# EAGLE design transformerless_5v_AC-DC_reulator (EAGLE 9.6.2)
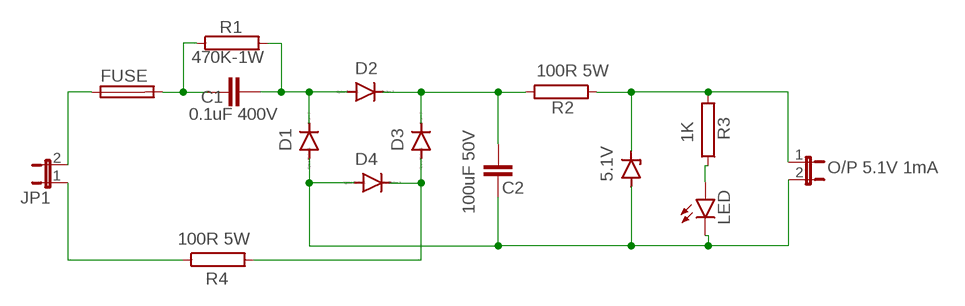
[diagram p0: schematic, sheet 1]

## Parts
C1  0.1uF 400V  C2,5-3  [C2.5-3]
C2  100uF 50V  C2,5-3  [C2.5-3]
D1  1N4004  [DO41-10]
D2  1N4004  [DO41-10]
D3  1N4004  [DO41-10]
D4  1N4004  [DO41-10]
FUSE  GSH15  [GSH15]
JP1  JP1E  [JP1]
LED  LED  [SMARTLED-TTW]
O/P  O/P 5.1V 1mA  JP1E  [JP1]
R1  470K-1W  RAC01  [AC01]
R2  100R 5W  RAC01  [AC01]
R3  1K  RAC01  [AC01]
R4  100R 5W  RAC01  [AC01]
ZENER  5.1V  ZPD  [DO35Z10]

## Nets
N$1: FUSE.1 JP1.2
N$2: C1.1 FUSE.2 R1.1
N$3: C1.2 D1.C D2.A R1.2
N$4: LED.A@1(A) R3.1
N$5: D3.A D4.C R4.2
N$6: C2.2 D1.A D4.A LED.C@1(C) O/P.2 ZENER.A
N$7: C2.1 D2.C D3.C R2.2
N$8: O/P.1 R2.1 R3.2 ZENER.C
N$9: JP1.1 R4.1

## Library data of the parts
C1 C2 = capacitor-wima:C: CAPACITOR naming: grid - package width
D1-D4 = diode:1N4004: DIODE general purpose rectifier, 1 A
FUSE = fuse:GSH15: FUSE HOLDER grid 15mm, 19649 Wickmann; MPN: 64900001039; OC_FARNELL: 1271673; OC_NEWARK: 02P0318
JP1 O/P = jumper:JP1E: JUMPER
LED = led:LED: LED OSRAM: - CHIPLED LG R971, LG N971, LY N971, LG Q971, LY Q971, LO R971, LY R971 LH N974, LH R974 LS Q976, LO Q976, LY Q976 LO Q996 - Hyper CHIPLED LW Q18S LB Q993, LB Q99A, LB R99A - SideLED LS A670, LO A670, LY A670, LG A670, LP A670 LB A673, LV A673, LT A673, LW A673 LH A674 LY A675 LS A676, LA A676, LO A676, LY A676, LW A676 LS A679, LY A679, LG A679 - Hyper Micro SIDELED® LS Y876, LA Y876, LO Y876, LY Y876 LT Y87S - SmartLED LW L88C, LW L88S LB L89C, LB L89S, LG L890 LS L89K, LO L89K, LY L89K LS L896, LA L896, LO L896, LY L896 - TOPLED LS T670, LO T670, LY T670, LG T670, LP T670 LSG T670, LSP T670, LSY T670, LOP T670, LYG T670 LG T671, LOG T671, LSG T671 LB T673, LV T673, LT T673, LW T673 LH T674 LS T676, LA T676, LO T676, LY T676, LB T676, LH T676, LSB T676, LW T676 LB T67C, LV T67C, LT T67C, LS T67K, LO T67K, LY T67K, LW E67C LS E67B, LA E67B, LO E67B, LY E67B, LB E67C, LV E67C, LT E67C LW T67C LS T679, LY T679, LG T679 LS T770, LO T770, LY T770, LG T770, LP T770 LB T773, LV T773, LT T773, LW T773 LH T774 LS E675, LA E675, LY E675, LS T675 LS T776, LA T776, LO T776, LY T776, LB T776 LHGB T686 LT T68C, LB T68C - Hyper Mini TOPLED® LB M676 - Mini TOPLED Santana® LG M470 LS M47K, LO M47K, LY M47K Source: http://www.osram.convergy.de LUXEON: - LUMILED® LXK2-PW12-R00, LXK2-PW12-S00, LXK2-PW14-U00, LXK2-PW14-V00 LXK2-PM12-R00, LXK2-PM12-S00, LXK2-PM14-U00 LXK2-PE12-Q00, LXK2-PE12-R00, LXK2-PE12-S00, LXK2-PE14-T00, LXK2-PE14-U00 LXK2-PB12-K00, LXK2-PB12-L00, LXK2-PB12-M00, LXK2-PB14-N00, LXK2-PB14-P00, LXK2-PB14-Q00 LXK2-PR12-L00, LXK2-PR12-M00, LXK2-PR14-Q00, LXK2-PR14-R00 LXK2-PD12-Q00, LXK2-PD12-R00, LXK2-PD12-S00 LXK2-PH12-R00, LXK2-PH12-S00 LXK2-PL12-P00, LXK2-PL12-Q00, LXK2-PL12-R00 Source: www.luxeon.com KINGBRIGHT: KA-3528ASYC Source: www.kingbright.com
R1-R4 = resistor-power:R: Power Resitor; OC_FARNELL: unknown; OC_NEWARK: unknown
ZENER = diode:ZPD: Z DIODE 500 mW

## Board
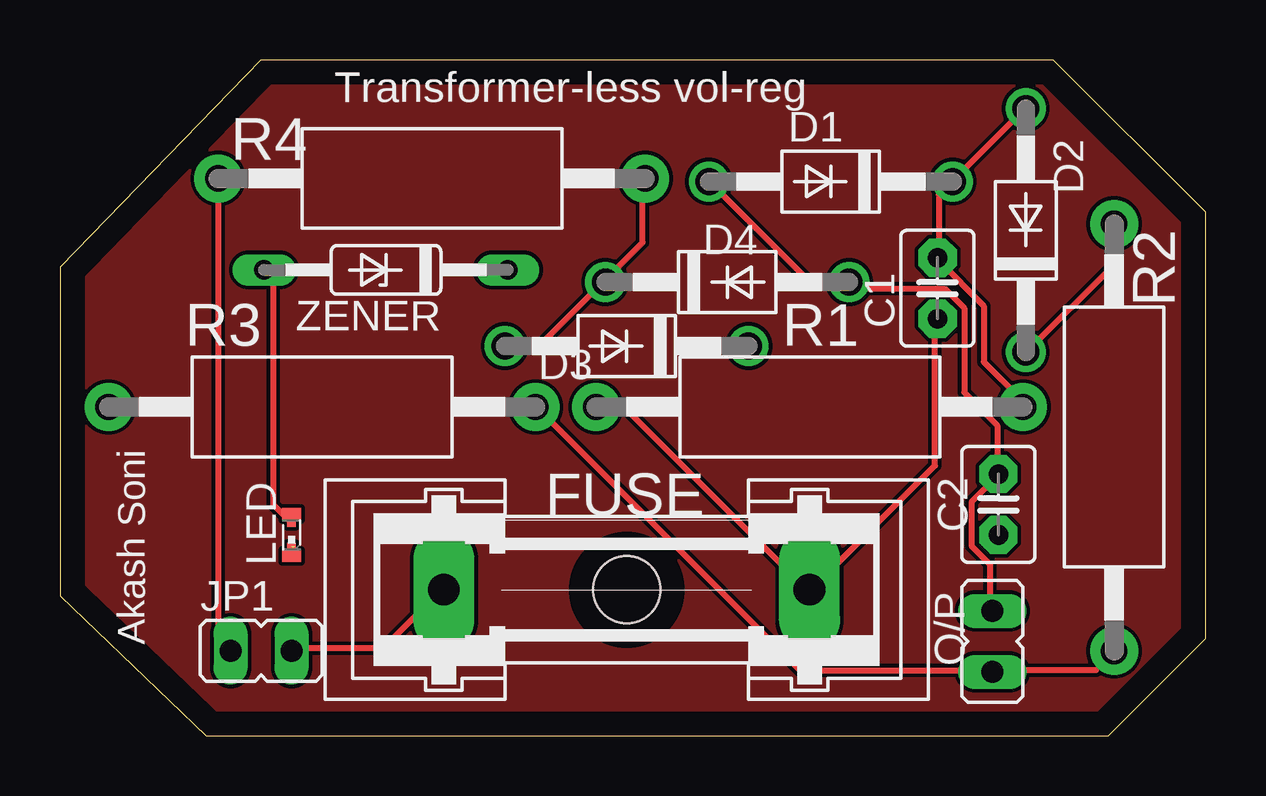
[diagram p1: board, top side]
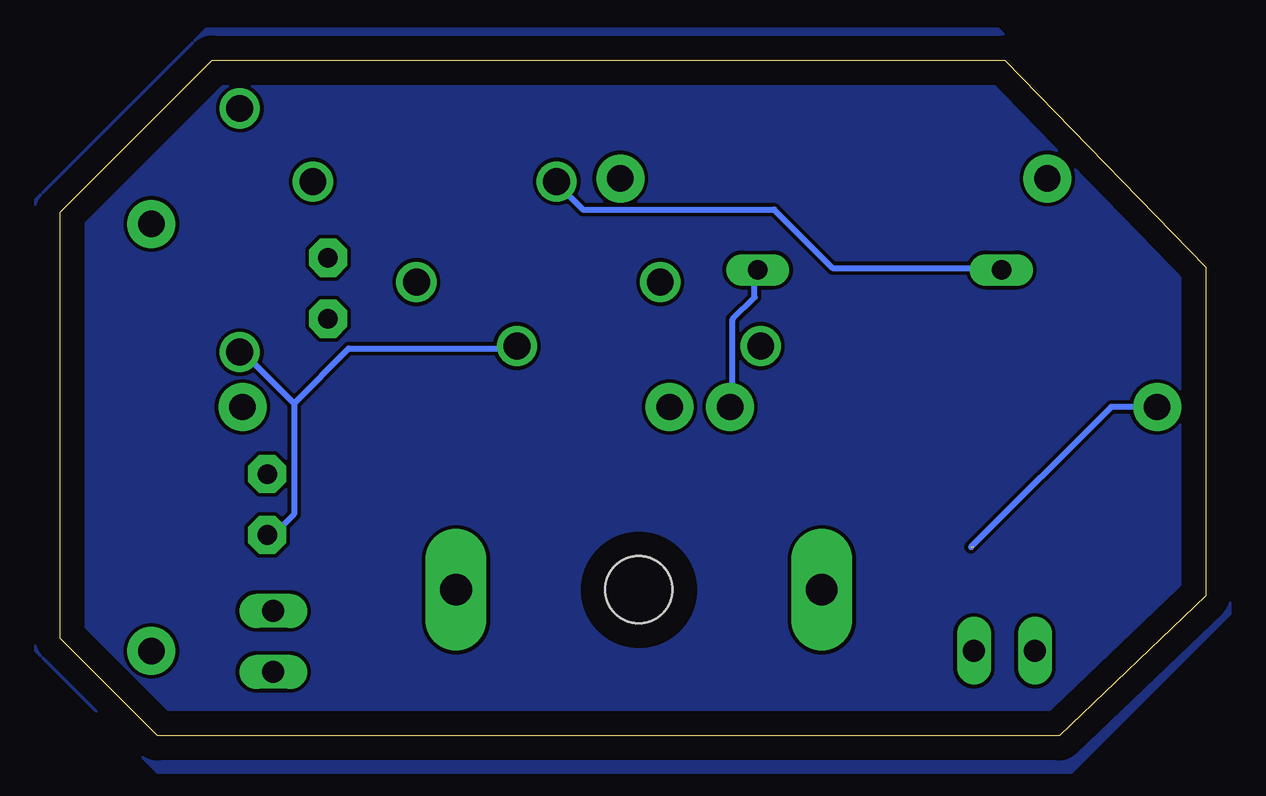
[diagram p2: board, bottom side, seen from below]

Size 47.75 x 28.18 mm. Coordinates in mm from the lower left corner, seen from the top.
Outline: 0,19.56 0,5.84 6.1,0 43.69,0 47.75,4.06 47.75,21.84 41.41,28.18 8.37,28.18 0,19.56
Copper layers (1*16): Top 0.035mm / dielectric 1.5mm / Bottom 0.035mm
Design rules "default": minimum track width 6mil, minimum drill 0.35mm, track to track 6mil, track to pad 6mil, pad to pad 6mil, via to via 6mil, smd to smd 6mil, copper to edge 40mil, drill to drill 6mil, minimum pad ring 10mil, minimum via ring 8mil, stop-mask expansion 4mil, vias tented up to drill 0mil, thermal gap 10mil

### Footprints (pad centres in the part's own frame; a part is rotated, then mirrored left to right if it is on the bottom)
C2.5-3 = drill 0.813 pad 1.6 octagon: 1 -1.27,0; 2 1.27,0
DO41-10 = drill 1.118: A 5.08,0; C -5.08,0
GSH15 = drill 1.321 pad 2.54 long: 1 -7.62,0; 2 7.62,0 | hole 2.794: 0,0
JP1 = drill 0.914 long: 1 0,-1.27; 2 0,1.27
SMARTLED-TTW = smd 0.8 x 0.5: A 0,-0.875; C 0,0.875 | smd 0.35 x 0.35: A@1 0,-0.5; C@1 0,0.5
AC01 = drill 1.1 pad 2: 1 -8.9,0; 2 8.9,0
DO35Z10 = drill 0.813 long: A 5.08,0; C -5.08,0

### Placement (x,y rotation side)
C1  36.58,18.67 90 top
C2  39.12,9.65 90 top
D1  32.13,23.11 180 top
D2  40.26,21.08 90 top
D3  23.62,16.26 180 top
D4  27.81,18.92 0 top
FUSE  23.62,6.1 0 top
JP1  8.38,3.56 270 top
LED  9.65,8.38 0 top
O/P  38.86,3.94 0 top
R1  31.24,13.72 0 top
R2  43.94,12.45 90 top
R3  10.92,13.72 0 top
R4  15.49,23.24 0 top
ZENER  13.59,19.43 180 top

### Tracks (layer width: path | path; a pad name or v marks a point on that pad's centre or on a via)
GND
  pour Top: -0.51,19.81 -0.51,5.59 5.59,-0.51 6.1,-1.02 43.69,-1.02 48.26,3.56 48.26,22.35 41.66,28.96 8.64,28.96
  pour Bottom: -1.02,19.81 -1.02,5.08 5.59,-1.52 43.69,-1.52 48.77,3.56 48.77,22.35 41.66,29.46 8.64,29.46
N$1
  Top 0.152: 9.65,3.66 JP1.2 | 15.9,6.1 FUSE.1
  Top 0.254: 9.65,3.66 13.46,3.66 15.9,6.1
N$2
  Top 0.152: 36.47,17.37 C1.1 | 31.29,6.1 FUSE.2 31.14,6.1 | 23.52,13.72 R1.1
  Top 0.254: 36.47,17.37 36.47,11.28 31.29,6.1 | 31.14,6.1 23.52,13.72
N$3
  Top 0.152: 36.63,22.55 37.08,23.01 D1.C 37.24,23.16 | 36.63,19.96 C1.2 36.63,19.81 | 40.13,26.06 D2.A | 40.13,13.97 R1.2
  Top 0.254: 36.63,22.55 36.63,19.96 | 37.24,23.16 40.13,26.06 | 40.13,13.97 38.51,15.6 38.51,17.93 36.63,19.81
N$4  (1 unrouted)
  Bottom 0.254: R3.1 3.94,13.72 9.78,7.87
N$5
  Top 0.152: 18.64,16.31 D3.A | 22.61,18.9 D4.C 22.76,19.05 | 24.28,23.16 R4.2
  Top 0.254: 18.64,16.31 20.02,16.31 22.61,18.9 | 24.28,23.16 24.28,20.57 22.76,19.05
N$6
  Top 0.152: 38.76,5.33 O/P.2 | 39.06,10.82 C2.2 39.06,10.97 | 31.14,19.05 32.82,19.05 D4.A 33.73,18.64 | 27.18,23.01 D1.A
  Top 0.254: 38.76,5.33 38.76,7.16 38,7.92 38,9.75 39.06,10.82 | 27.18,23.01 31.14,19.05 | 39.06,10.97 39.06,12.95 37.69,14.33 37.69,17.83 36.88,18.64 33.73,18.64 | LED.C@1 8.89,9.64 8.89,19.05 ZENER.A
  Bottom 0.152: 8.59,19.51 ZENER.A | 27.03,23.01 D1.A
  Bottom 0.254: 8.59,19.51 15.54,19.51 17.98,21.95 25.96,21.95 27.03,23.01
N$7
  Top 0.152: 40.28,16 D2.C
  Top 0.254: R2.2 43.94,19.66 40.28,16
  Bottom 0.152: 40.13,16 D2.C | 28.7,16.15 D3.C
  Bottom 0.254: C2.1 38.86,8.38 38,9.25 38,13.87 | 40.13,16 38,13.87 | 28.7,16.15 35.71,16.15 38,13.87
N$8
  Top 0.152: 43.18,2.74 43.94,3.5 R2.1 | 38.91,2.74 O/P.1 38.76,2.74 | 19.86,13.72 R3.2
  Top 0.254: 43.18,2.74 38.91,2.74 | 38.76,2.74 30.84,2.74 19.86,13.72
  Bottom 0.152: 18.8,19.36 ZENER.C | 19.71,13.72 R3.2
  Bottom 0.254: 18.8,19.36 18.8,18.29 19.71,17.37 19.71,13.72
N$9
  Top 0.152: 7.06,3.66 JP1.1
  Top 0.254: 7.06,3.66 7.06,4.17 6.6,4.62 6.6,21.98 6.59,21.99 R4.1

### Text on the board
tPlace: Transformer-less vol-reg | Akash Soni